# Altium schematic sheet KS2E_PCHG_HVSIDE.SchDoc
size A; SheetNumber: 3; SheetTotal: 3
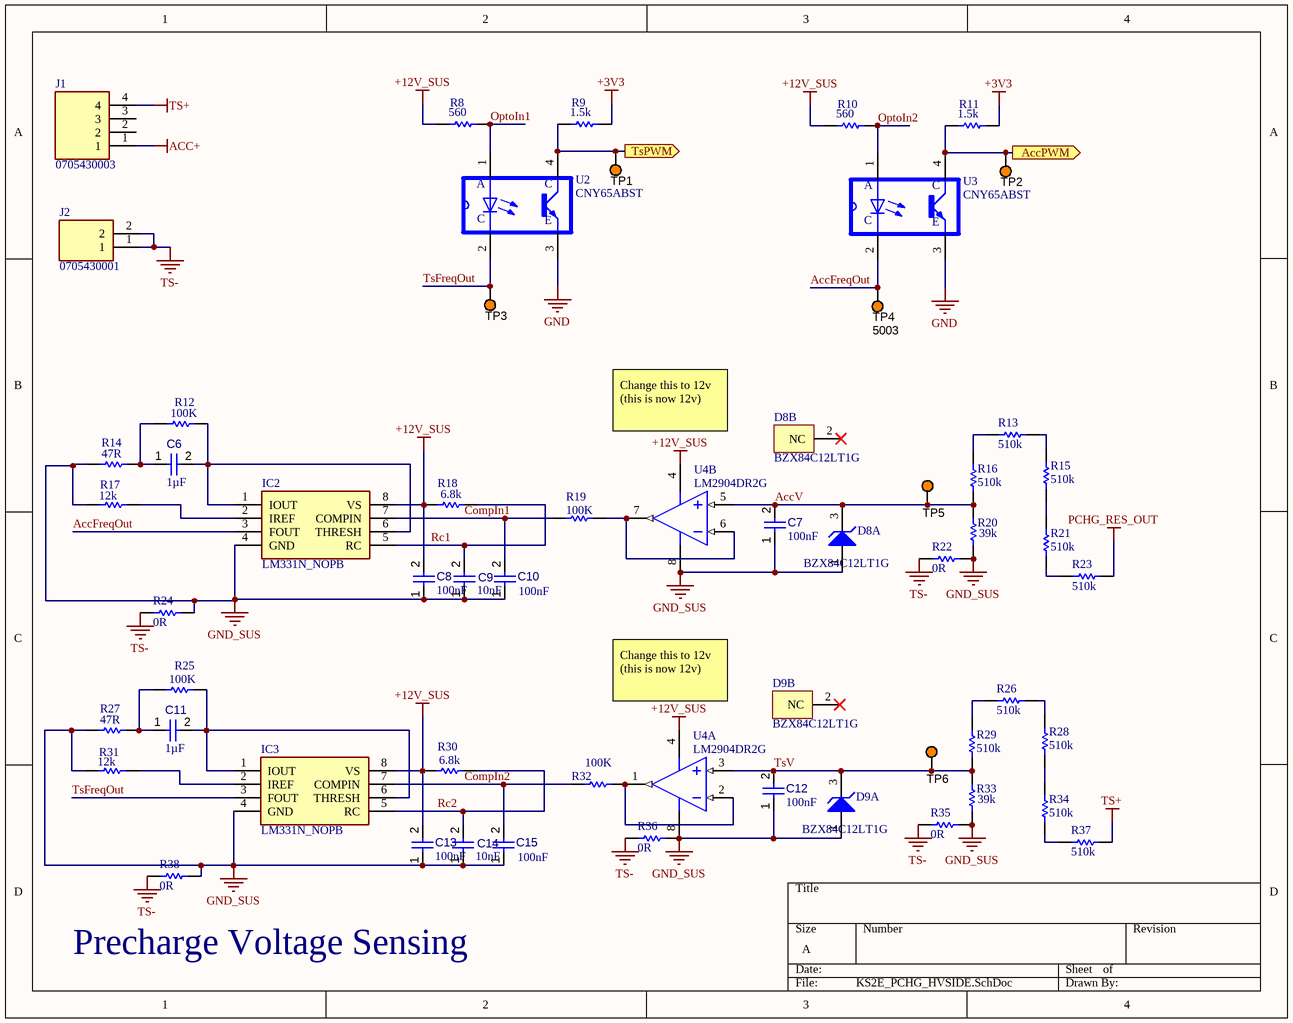
[diagram p0: KS2E_PCHG_HVSIDE.SchDoc]

## Parts
C6  value 1µF  [CAPC0603(1608)100_L]  (hidden comment: Capacitor 1µF +/-0.1% 25V 0603)
C7  value 100nF  [CAPC1608X90X40NL10T20]  (hidden comment: Capacitor 100 nF +/-10% 50 V 0603)
C8  value 100nF  [CAPC1608X90X40NL10T20]  (hidden comment: Capacitor 100 nF +/-10% 50 V 0603)
C9  value 10nF  [CAPC1608X90X40NL10T20]  (hidden comment: Capacitor 100 nF +/-10% 50 V 0603)
C10  value 100nF  [CAPC1608X90X40NL10T20]  (hidden comment: Capacitor 100 nF +/-10% 50 V 0603)
C11  value 1µF  [CAPC0603(1608)100_L]  (hidden comment: Capacitor 1µF +/-0.1% 25V 0603)
C12  value 100nF  [CAPC1608X90X40NL10T20]  (hidden comment: Capacitor 100 nF +/-10% 50 V 0603)
C13  value 100nF  [CAPC1608X90X40NL10T20]  (hidden comment: Capacitor 100 nF +/-10% 50 V 0603)
C14  value 10nF  [CAPC1608X90X40NL10T20]  (hidden comment: Capacitor 100 nF +/-10% 50 V 0603)
C15  value 100nF  [CAPC1608X90X40NL10T20]  (hidden comment: Capacitor 100 nF +/-10% 50 V 0603)
D8  BZX84C12LT1G  [ONSC-SOT-23-3-318-08_V]  (parts A,B of 2)
D9  BZX84C12LT1G  [ONSC-SOT-23-3-318-08_V]  (parts A,B of 2)
IC2  LM331N_NOPB  [DIP794W53P254L959H508Q8N]
IC3  LM331N_NOPB  [DIP794W53P254L959H508Q8N]
J1  0705430003  [SHDR4W64P0X254_1X4_1271X660X1181P]
J2  0705430001  [SHDR2W64P0X254_1X2_737X660X1181P]
R8  Resistance: 560  [RESC1609X55X30LL15T15]  (hidden comment: ERJ3EKF1002V)
R9  Resistance: 1.5k  [RESC1609X55X30LL15T15]  (hidden comment: ERJ3EKF1002V)
R10  Resistance: 560  [RESC1609X55X30LL15T15]  (hidden comment: ERJ3EKF1002V)
R11  Resistance: 1.5k  [RESC1609X55X30LL15T15]  (hidden comment: ERJ3EKF1002V)
R12  Resistance: 100K  [RESC1609X55X30LL15T15]  (hidden comment: ERJ3EKF1002V)
R13  510k  [RESC2013X60X40NL20T25]
R14  Resistance: 47R  [RESC1609X55X30LL15T15]  (hidden comment: ERJ3EKF1002V)
R15  510k  [RESC2013X60X40NL20T25]
R16  510k  [RESC2013X60X40NL20T25]
R17  Resistance: 12k  [RESC1609X55X30LL15T15]  (hidden comment: ERJ3EKF1002V)
R18  Resistance: 6.8k  [RESC1609X55X30LL15T15]  (hidden comment: ERJ3EKF1002V)
R19  Resistance: 100K  [RESC1609X55X30LL15T15]  (hidden comment: ERJ3EKF1002V)
R20  39k  [RESC2013X60X40LL20T25]
R21  510k  [RESC2013X60X40NL20T25]
R22  0R  [RESC2013X65X40LL15T20]
R23  510k  [RESC2013X60X40NL20T25]
R24  0R  [RESC2013X65X40LL15T20]
R25  Resistance: 100K  [RESC1609X55X30LL15T15]  (hidden comment: ERJ3EKF1002V)
R26  510k  [RESC2013X60X40NL20T25]
R27  Resistance: 47R  [RESC1609X55X30LL15T15]  (hidden comment: ERJ3EKF1002V)
R28  510k  [RESC2013X60X40NL20T25]
R29  510k  [RESC2013X60X40NL20T25]
R30  Resistance: 6.8k  [RESC1609X55X30LL15T15]  (hidden comment: ERJ3EKF1002V)
R31  Resistance: 12k  [RESC1609X55X30LL15T15]  (hidden comment: ERJ3EKF1002V)
R32  Resistance: 100K  [RESC1609X55X30LL15T15]  (hidden comment: ERJ3EKF1002V)
R33  value 39k  [RESC2013X60X40LL20T25]  (hidden comment: ERA6AEB393V)
R34  510k  [RESC2013X60X40NL20T25]
R35  0R  [RESC2013X65X40LL15T20]
R36  0R  [RESC2013X65X40LL15T20]
R37  510k  [RESC2013X60X40NL20T25]
R38  0R  [RESC2013X65X40LL15T20]
TP1  5003  [KSTN-5003]  (value not drawn)
TP2  5003  [KSTN-5003]  (value not drawn)
TP3  5003  [KSTN-5003]  (value not drawn)
TP4  5003  [KSTN-5003]
TP5  5003  [KSTN-5003]  (value not drawn)
TP6  5003  [KSTN-5003]  (value not drawn)
U2  CNY65ABST  [SOIC762P1940X755-4N]
U3  CNY65ABST  [SOIC762P1940X755-4N]
U4  LM2904DR2G  [ONSC-SOIC-8-751-07_V]  (parts A,B of 2)

## Ports
AccPWM (out), TsPWM (out)

## Nets
+3V3: R9.1 R11.1
+12V_SUS: C8.2 C13.2 IC2.8(VS) IC3.8(VS) R8.1 R10.1 R18.1 R30.1 U4.4(VEE/GND)
ACC+: J1.1
GND: U2.3(E) U3.3(E)
GND_SUS: C7.1 C8.1 C9.1 C10.1 C12.1 C13.1 C14.1 C15.1 D8.1(A) D9.1(A) IC2.4(GND) IC3.4(GND) R14.1 R17.1 R20.1 R22.1 R24.1 R27.1 R31.1 R33.1 R35.1 R36.1 R38.1 U4.8(VCC)
PCHG_RES_OUT: R23.2
TS+: J1.4 R37.2
TS-: J2.1 J2.2 R22.2 R24.2 R35.2 R36.2 R38.2
AccFreqOut: IC2.3(FOUT) TP4.1 U3.2(C)
AccPWM: R11.2 TP2.1 U3.4(C`) ; port AccPWM
AccV: C7.2 D8.3(K) R16.2 R20.2 TP5.1 U4.5(INB+)
CompIn1: C10.2 IC2.7(COMPIN) R19.1
CompIn2: C15.2 IC3.7(COMPIN) R32.1
OptoIn1: R8.2 U2.1(A)
OptoIn2: R10.2 U3.1(A)
Rc1: C9.2 IC2.5(RC) R18.2
Rc2: C14.2 IC3.5(RC) R30.2
TsFreqOut: IC3.3(FOUT) TP3.1 U2.2(C)
TsPWM: R9.2 TP1.1 U2.4(C`) ; port TsPWM
TsV: C12.2 D9.3(K) R29.2 R33.2 TP6.1 U4.3(INA+)
NetC6_1: C6.1 R12.1 R14.2
NetC6_2: C6.2 IC2.1(IOUT) IC2.6(THRESH) R12.2
NetC11_1: C11.1 R25.1 R27.2
NetC11_2: C11.2 IC3.1(IOUT) IC3.6(THRESH) R25.2
NetIC2_2: IC2.2(IREF) R17.2
NetIC3_2: IC3.2(IREF) R31.2
NetR13_1: R13.1 R15.2
NetR13_2: R13.2 R16.1
NetR15_1: R15.1 R21.1
NetR19_2: R19.2 U4.6(INB-) U4.7(OUTB)
NetR21_2: R21.2 R23.1
NetR26_1: R26.1 R28.2
NetR26_2: R26.2 R29.1
NetR28_1: R28.1 R34.1
NetR32_2: R32.2 U4.1(OUTA) U4.2(INA-)
NetR34_2: R34.2 R37.1

Not connected (* = marked no-connect by the designer): D8 2(NC)*; D9 2(NC)*; J1 2 3

## Notes on the sheet
- Change this to 12v
  (this is now 12v)
- Precharge Voltage Sensing

## Library data of the parts
C6 C11 = CMP-001-00055-4: Chip Capacitor, 1µF +/-0.1%, 25V, 0603, Thickness 1 mm; Tolerance: 20%; Min Operating Temperature: -55°C; Max Operating Temperature: 85°C; Voltage Rating: 25V; Mounting Technology: SMT; Case/Package: 0603; Pins: 2
C7-C10 C12-C15 = CMP-001-00017-6: Chip Capacitor, 100 nF, +/- 10%, 50 V, 0603 (1608 Metric); Voltage Rating: 50V; Capacitor Type: Ceramic; Tolerance: 10%; Mounting Technology: SM; Max Operating Temperature: 125°C; RoHS Compliant: True; Pins: 2; Case/Package: 0603; Min Operating Temperature: -55°C
D8 D9 = CMP-1060-00857-1: Zener Voltage Regulator, 225 mW, 3-Pin SOT-23, Pb-Free, Tape and Reel; Manufacturer: On Semiconductor; PackageDescription: 3-Pin Small Outline Transistor, Body 2.92 x 1.3 mm, Pitch 0.95 mm; ComponentLink1URL: http://www.onsemi.com/; ComponentLink3URL: http://www.onsemi.cn/pub_link/Collateral/318-08.PDF; Mounting Technology: Surface Mount; PartNumber: BZX84C12LT1G; ComponentLink3Description: Package Specification; RoHS: Pb-Free; DatasheetVersion: Rev. 17; ComponentLink2URL: http://www.onsemi.com/pub_link/Collateral/BZX84C2V4LT1-D.PDF; ComponentLink2Description: Datasheet; ComponentLink1Description: Manufacturer URL; Packing: Tape and Reel; PackageReference: SOT-23-3-318-08; PackageVersion: Rev. AP, 11/2009
IC2 IC3 = LM331N_NOPB: Integrated Circuit; Manufacturer_Name: Texas Instruments; Manufacturer_Part_Number: LM331N/NOPB; Datasheet Link: http://www.ti.com/lit/ds/symlink/lm231.pdf; Height: 5.08mm; Mouser Part Number: 926-LM331N/NOPB; Mouser Price/Stock: https://www.mouser.co.uk/ProductDetail/Texas-Instruments/LM331N-NOPB?qs=X1J7HmVL2ZHJklHIKp8KMQ%3D%3D; Arrow Part Number: LM331N/NOPB; Arrow Price/Stock: https://www.arrow.com/en/products/lm331nnopb/texas-instruments?region=nac
J1 = 0705430003: Connector; Manufacturer_Name: Molex; Datasheet Link: https://www.molex.com/pdm_docs/sd/705430001_sd.pdf; Height: 11.81mm; Manufacturer_Part_Number: 0705430003; Mouser Part Number: N/A; Mouser Price/Stock: https://www.mouser.co.uk/ProductDetail/Molex/0705430003?qs=PBcRNPEHKsrDKEIJAwSKnQ%3D%3D; Arrow Part Number: 0705430003; Arrow Price/Stock: https://www.arrow.com/en/products/0705430003/molex
J2 = 0705430001: Connector; Manufacturer_Name: Molex; Datasheet Link: https://www.molex.com/webdocs/datasheets/pdf/en-us/0705430001_PCB_HEADERS.pdf; Height: 11.81mm; Manufacturer_Part_Number: 0705430001; Mouser Part Number: N/A; Mouser Price/Stock: https://www.mouser.co.uk/ProductDetail/Molex/0705430001?qs=PBcRNPEHKsrZYrVlaLTOSA%3D%3D; Arrow Part Number: 0705430001; Arrow Price/Stock: https://www.arrow.com/en/products/0705430001/molex?region=europe
R8-R12 R14 R17-R19 R25 R27 R30-R32 = CMP-1012-00623-3: Chip Resistor, 10 KOhm, +/- 1%, 0.1 W, -55 to 155 degC, 0603 (1608 Metric), RoHS, Tape and Reel; Manufacturer: Panasonic; Voltage Rating: 75V; Case\/Package: 0603; Power Rating: 100mW; Temperature Coefficient: 100ppm\/degreesC; Number of Pins: 2; Package Reference: 603; Depth: 0.8mm; Mount: SurfaceMount; Package Description: 2-Pin Surface Mount Device, Body 1.6 x 0.85 mm; Datasheet Version: 02/2017; Length: 1.6mm; Lead Free: LeadFree; Height: 0.45mm; Number of Terminations: 2; Max Power Dissipation: 100mW; Min Operating Temperature: -55degC; Datasheet URL: https://industrial.panasonic.com/cdbs/www-data/pdf/RDA0000/AOA0000C304.pdf; Termination: SMD/SMT; Case Code (Metric): 1608; Case Code (Imperial): 0603; Tolerance: 1%; Max Operating Temperature: 155degC; RoHSCompliant: true; Voltage Rating (DC): 75V; Radiation Hardening: No; Packaging: TapeandReel; Composition: ThickFilm; Mounting Technology: SurfaceMount; Manufacturer URL: http://www.panasonic.com/; Width: 0.031inch; REACH SVHC: NoSVHC; Contact Plating: Tin; Military Standard: Not; Package Quantity: 1
R13 R15 R16 R21 R23 R26 R28 R29 R34 R37 = CMP-2001-00651-1: Part Number: ERA-6AEB514V; Manufacturer: Panasonic
R20 = CMP-2001-00636-1: Manufacturer: Panasonic; Part Number: ERA6AEB393V; Value: 39k
R22 R24 R35 R36 R38 = CMP-2000-07514-1: Chip Resistor, 0 Ohm, 0.125 W, -55 to 125 degC, 0805 (2012 Metric), RoHS, Tape and Reel; Manufacturer: TE Connectivity; Power Rating: 125mW; Voltage Rating: 150V; Tolerance: 0%; Case\/Package: 0805; Number of Resistors: 1; Resistance: 0mOhm; Datasheet URL: www.te.com/commerce/DocumentDelivery/DDEController?Action=showdoc&DocId=Customer+Drawing%7F1623401%7FBA%7Fpdf%7FEnglish%7FENG_CD_1623401_BA.pdf%7F1623401-1; Composition: ThickFilm; Max Operating Temperature: 125degC; Min Operating Temperature: -55degC; ELV: Compliant; Case Code (Metric): 2012; Number of Terminations: 2; Weight: 0.000194oz; Length: 2mm; Mount: SurfaceMount; Packaging: TapeandReel; Case Code (Imperial): 0805; RoHSCompliant: true; Width: 1.25mm; Radiation Hardening: No; Termination: Solder; Manufacturer URL: http://www.te.com/; Package Description: 2-Pin Surface Mount Device, Body 2 x 1.25 mm; Mounting Technology: SurfaceMount; Height: 0.55mm; Package Quantity: 5000; Package Reference: RESC2013X65X40L15T20; Datasheet Version: Rev. BA, 12/2009; Depth: 1.25mm
R33 = CMP-2001-00636-1: Manufacturer: Panasonic; Part Number: ERA6AEB393V
TP1-TP6 = CMP-002-00037-2: Test Point, Orange, Height 4.6 mm, Tail Length 3 mm, 1-Pin THD, RoHS; Manufacturer: Keystone; Colour: Orange; Packaging: Bulk; Package Description: 1-Pin Through Hole Device, Dia 2.54 mm; Pins: 1; Package Reference: 5003; Datasheet Version: Jun-15; Case/Package: 5003; Mounting Technology: TH; Connector Type: TestPoint; Diameter: 2.54mm; Contact Material: Bronze; Datasheet URL: http://keyelco.com/userAssets/file/M65p56.pdf; Manufacturer URL: http://www.keyelco.com/; Package Quantity: 10; Contact Plating: Tin; RoHS Compliant: True
U2 U3 = CNY65ABST: Semiconductor, Optocoupler; 600 mil High Voltage Isolation Dist; CTR, 80-240%; SMD-4; MF: Vishay Semiconductor; Value: *; MP: CNY65ABST; SnapEDA_Link: https://www.snapeda.com/parts/CNY65ABST/Vishay%20Semiconductor%20Opto%20Division/view-part/461465/?ref=snap; Availability: Unavailable; Package: SMD-4 Vishay; Price: None
U4 = CMP-1310-00321-1: Single Supply Dual Operational Amplifier, 3 to 32 V, -40 to 105 degC, 8-Pin SOIC, Pb-Free, Tape and Reel; Manufacturer: On Semiconductor; VCC Min (V): 3; VCC Max (V): 32; PackageDescription: 8-Pin Small Outline Integrated Circuit, Body 4.9 x 3.9 mm, Pitch 1.27 mm; RoHS: TRUE; ComponentLink1URL: http://www.onsemi.com/; Mounting Technology: Surface Mount; PackageReference: SOIC-8-751-07; Packing: Tape and Reel; DatasheetVersion: Rev. 27; PartNumber: LM2904DR2G; PackageVersion: Rev. AK, 02/2011; ComponentLink1Description: Manufacturer URL; ComponentLink3URL: http://www.onsemi.com/pub_link/Collateral/751-07.PDF; ComponentLink2Description: Datasheet; ComponentLink3Description: Package Specification; ComponentLink2URL: http://www.onsemi.cn/pub_link/Collateral/LM358-D.PDF